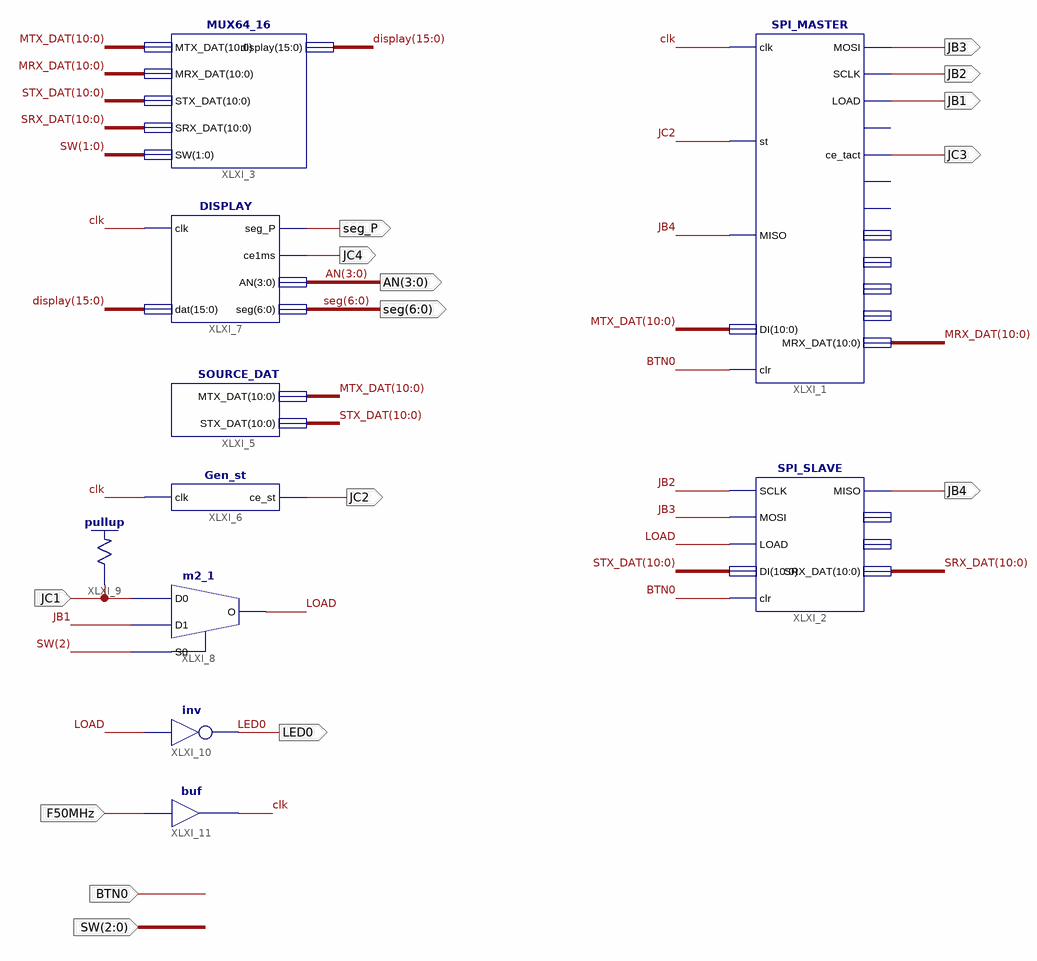
[diagram p0: schematic sheet 1]
// Xilinx ISE schematic Sch_Lab407_ND.sch (spartan3e) as structural Verilog: 10 symbols, 15 ports
module Sch_Lab407_ND (
  input  BTN0,
  input  JC1,
  input  F50MHz,
  input  [2:0] SW,
  output JB3,
  output JB2,
  output JB1,
  output JC3,
  output JC2,
  output JB4,
  output [6:0] seg,
  output [3:0] AN,
  output JC4,
  output seg_P,
  output LED0
);

  wire clk, LOAD;
  wire [10:0] MRX_DAT, MTX_DAT, SRX_DAT, STX_DAT;
  wire [15:0] display;

  SPI_MASTER XLXI_1 (
    .clk(clk), .st(JC2), .MISO(JB4), .clr(BTN0), .DI(MTX_DAT), .MOSI(JB3), .SCLK(JB2), .LOAD(JB1),
    .ce_tact(JC3), .MRX_DAT(MRX_DAT));  // open: end_TX, ce, start, cb_bit, cb_tact, sr_MRX, sr_MTX
  SPI_SLAVE XLXI_2 (
    .SCLK(JB2), .MOSI(JB3), .LOAD(LOAD), .clr(BTN0), .DI(STX_DAT), .MISO(JB4), .SRX_DAT(SRX_DAT));  // open: sr_SRX, sr_STX
  MUX64_16 XLXI_3 (
    .MTX_DAT(MTX_DAT), .MRX_DAT(MRX_DAT), .STX_DAT(STX_DAT), .SRX_DAT(SRX_DAT), .SW(SW[1:0]),
    .display(display));
  SOURCE_DAT XLXI_5 (.MTX_DAT(MTX_DAT), .STX_DAT(STX_DAT));
  Gen_st XLXI_6 (.clk(clk), .ce_st(JC2));
  DISPLAY XLXI_7 (.clk(clk), .dat(display), .seg_P(seg_P), .ce1ms(JC4), .AN(AN), .seg(seg));
  m2_1 XLXI_8 (.D0(JC1), .D1(JB1), .S0(SW[2]), .O(LOAD));
  \pullup  XLXI_9 (.O(JC1));
  not XLXI_10 (LED0, LOAD);
  buf XLXI_11 (clk, F50MHz);
endmodule
